# EAGLE schematic micro_RevA (EAGLE 6.5.0)
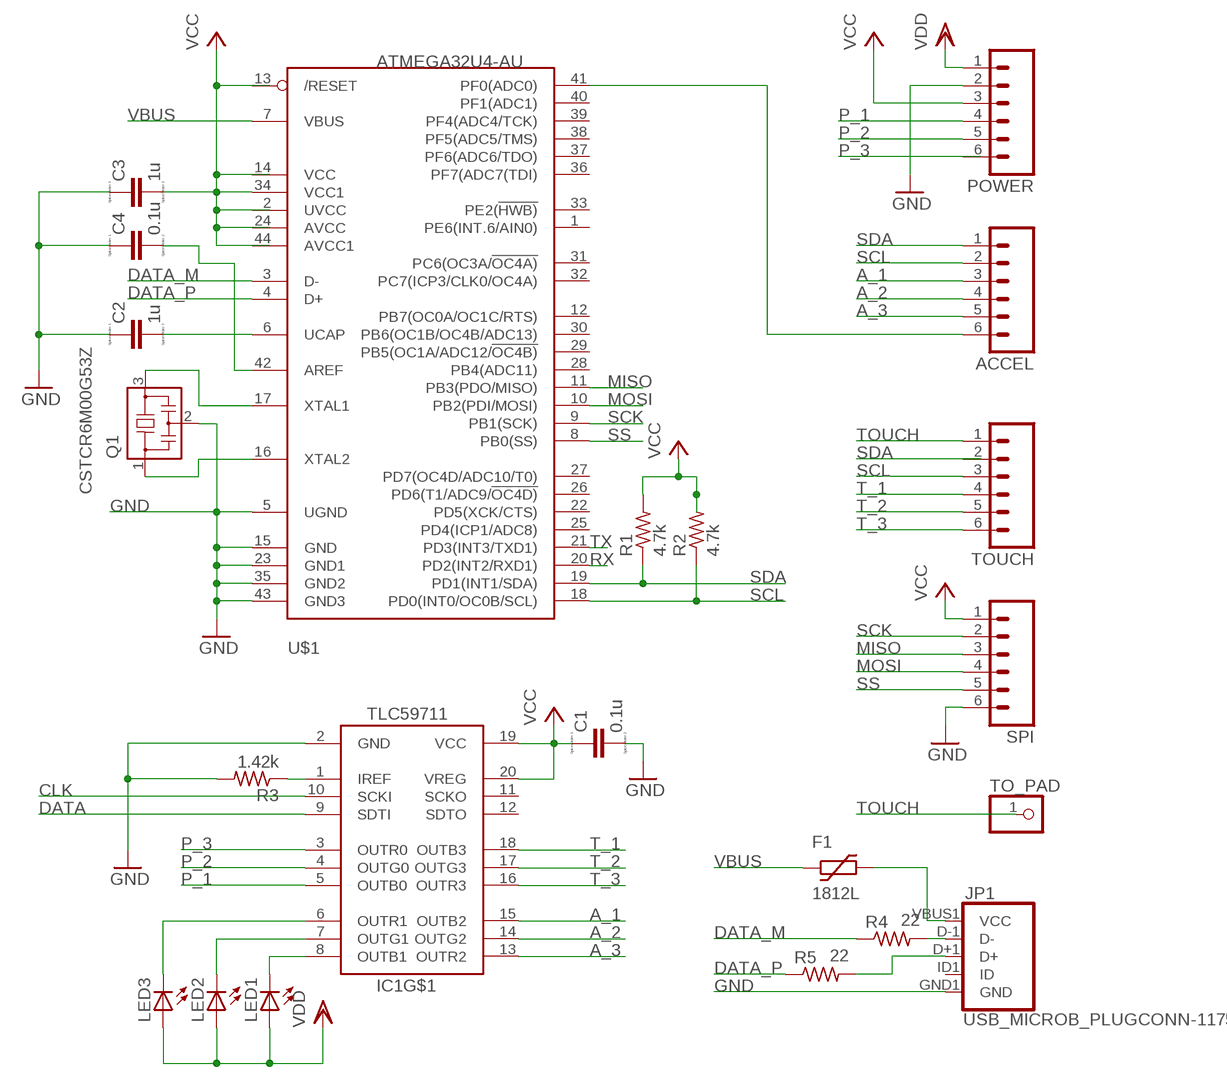
[diagram p0: schematic, sheet 1]

## Parts
ACCEL  M06SMD-STRAIGHT-ALT  [1X06_SMD_STRAIGHT_ALT]
C1  0.1u  CC0603  [C0603]
C2  1u  CC0603  [C0603]
C3  1u  CC0603  [C0603]
C4  0.1u  CC0603  [C0603]
F1  1812L  [1812L]
IC1  TLC59711  [HTSSOP20DAP]
JP1  USB_MICROB_PLUGCONN-11752  [USB-B-MICRO-SMD_V03]
LED1  LEDP-LCC-4  [P-LCC-4]
LED2  LEDP-LCC-4  [P-LCC-4]
LED3  LEDP-LCC-4  [P-LCC-4]
POWER  M06SMD-STRAIGHT-ALT  [1X06_SMD_STRAIGHT_ALT]
Q1  CSTCR6M00G53Z  [CSTCR6M]
R1  4.7k  R-US_R0603  [R0603]
R2  4.7k  R-US_R0603  [R0603]
R3  1.42k  R-US_R0603  [R0603]
R4  22  R-US_R0603  [R0603]
R5  22  R-US_R0603  [R0603]
SPI  M06SMD-STRAIGHT-ALT  [1X06_SMD_STRAIGHT_ALT]
TO_PAD  PINHD-1X1  [1X01]
TOUCH  M06SMD-STRAIGHT-ALT  [1X06_SMD_STRAIGHT_ALT]
U$1  ATMEGA32U4-AU  [TQFP44]

## Nets
A_1: ACCEL.3 IC1.15(OUTB2)
A_2: ACCEL.4 IC1.14(OUTG2)
A_3: ACCEL.5 IC1.13(OUTR2)
CLK: IC1.10(SCKI)
DATA: IC1.9(SDTI)
DATA_M: R4.1 U$1.3(D-)
DATA_P: R5.1 U$1.4(D+)
GND: C1.2 C2.1 C3.1 C4.1 IC1.2(GND) JP1.GND1(GND) POWER.2 Q1.2 R3.2 SPI.6 U$1.5(UGND) U$1.15(GND) U$1.23(GND1) U$1.35(GND2) U$1.43(GND3)
MISO: SPI.3 U$1.11(PB3(PDO/MISO))
MOSI: SPI.4 U$1.10(PB2(PDI/MOSI))
N$1: Q1.3 U$1.17(XTAL1)
N$2: Q1.1 U$1.16(XTAL2)
N$3: C4.2 U$1.42(AREF)
N$4: IC1.1(IREF) R3.1
N$5: IC1.6(OUTR1) LED3.C@4(C)
N$6: IC1.7(OUTG1) LED2.C@4(C)
N$7: IC1.8(OUTB1) LED1.C@4(C)
N$8: C2.2 U$1.6(UCAP)
N$9: ACCEL.6 U$1.41(PF0(ADC0))
N$10: JP1.D-1(D-) R4.2
N$11: JP1.D+1(D+) R5.2
N$12: F1.P$2 JP1.VBUS1(VCC)
P_1: IC1.5(OUTB0) POWER.4
P_2: IC1.4(OUTG0) POWER.5
P_3: IC1.3(OUTR0) POWER.6
RX: U$1.20(PD2(INT2/RXD1))
SCK: SPI.2 U$1.9(PB1(SCK))
SCL: ACCEL.2 R2.1 TOUCH.3 U$1.18(PD0(INT0/OC0B/SCL))
SDA: ACCEL.1 R1.1 TOUCH.2 U$1.19(PD1(INT1/SDA))
SS: SPI.5 U$1.8(PB0(SS))
T_1: IC1.18(OUTB3) TOUCH.4
T_2: IC1.17(OUTG3) TOUCH.5
T_3: IC1.16(OUTR3) TOUCH.6
TOUCH: TO_PAD.1 TOUCH.1
TX: U$1.21(PD3(INT3/TXD1))
VBUS: F1.P$1 U$1.7(VBUS)
VCC: C1.1 C3.2 IC1.19(VCC) IC1.20(VREG) POWER.3 R1.2 R2.2 SPI.1 U$1.34(VCC1)
VDD: LED1.A LED2.A LED3.A POWER.1
Unconnected: IC1.11(SCKO) IC1.12(SDTO) IC1.EXP(PAD) JP1.ID1(ID) U$1.1(PE6(INT.6/AIN0)) U$1.2(UVCC) U$1.12(PB7(OC0A/OC1C/RTS)) U$1.13(/RESET) U$1.14(VCC) U$1.22(PD5(XCK/CTS)) U$1.24(AVCC) U$1.25(PD4(ICP1/ADC8)) U$1.26(PD6(T1/ADC9/!OC4D)) U$1.27(PD7(OC4D/ADC10/T0)) U$1.28(PB4(ADC11)) U$1.29(PB5(OC1A/ADC12/!OC4B)) U$1.30(PB6(OC1B/OC4B/ADC13)) U$1.31(PC6(OC3A/!OC4A)) U$1.32(PC7(ICP3/CLK0/OC4A)) U$1.33(PE2(!HWB)) U$1.36(PF7(ADC7(TDI)) U$1.37(PF6(ADC6/TDO)) U$1.38(PF5(ADC5/TMS)) U$1.39(PF4(ADC4/TCK)) U$1.40(PF1(ADC1)) U$1.44(AVCC1)

## Library data of the parts
ACCEL POWER SPI TOUCH = SparkFun-Connectors:M06: Header 6 Standard 6-pin 0.1" header. Use with straight break away headers (SKU : PRT-00116), right angle break away headers (PRT-00553), swiss pins (PRT-00743), machine pins (PRT-00117), and female headers (PRT-00115). Molex polarized connector foot print use with SKU : PRT-08094 with associated crimp pins and housings. NOTES ON THE VARIANTS LOCK and LOCK_LONGPADS... This footprint was designed to help hold the alignment of a through-hole component (i.e. 6-pin header) while soldering it into place. You may notice that each hole has been shifted either up or down by 0.005 of an inch from it's more standard position (which is a perfectly straight line). This slight alteration caused the pins (the squares in the middle) to touch the edges of the holes. Because they are alternating, it causes a "brace" to hold the component in place. 0.005 has proven to be the perfect amount of "off-center" position when using our standard breakaway headers. Although looks a little odd when you look at the bare footprint, once you have a header in there, the alteration is very hard to notice. Also,if you push a header all the way into place, it is covered up entirely on the bottom side. This idea of altering the position of holes to aid alignment will be further integrated into the Sparkfun Library for other footprints. It can help hold any component with 3 or more connection pins.
C1-C4 = eagle-ltspice:C: CAPACITOR, European symbol; SPICEMODEL: NONE; SPICEPREFIX: C
F1 = ptc-littlefuse:1812L
IC1 = adafruit:TLC59711
JP1 = SparkFun-Connectors:USB_MICROB_PLUG: USB Micro-B connectors Some male, some female. Watch your step!; PROD_ID: CONN-11752
LED1-LED3 = led:LED: LED OSRAM: - CHIPLED LG R971, LG N971, LY N971, LG Q971, LY Q971, LO R971, LY R971 LH N974, LH R974 LS Q976, LO Q976, LY Q976 LO Q996 - Hyper CHIPLED LW Q18S LB Q993, LB Q99A, LB R99A - SideLED LS A670, LO A670, LY A670, LG A670, LP A670 LB A673, LV A673, LT A673, LW A673 LH A674 LY A675 LS A676, LA A676, LO A676, LY A676, LW A676 LS A679, LY A679, LG A679 - Hyper Micro SIDELED® LS Y876, LA Y876, LO Y876, LY Y876 LT Y87S - SmartLED LW L88C, LW L88S LB L89C, LB L89S, LG L890 LS L89K, LO L89K, LY L89K LS L896, LA L896, LO L896, LY L896 - TOPLED LS T670, LO T670, LY T670, LG T670, LP T670 LSG T670, LSP T670, LSY T670, LOP T670, LYG T670 LG T671, LOG T671, LSG T671 LB T673, LV T673, LT T673, LW T673 LH T674 LS T676, LA T676, LO T676, LY T676, LB T676, LH T676, LSB T676, LW T676 LB T67C, LV T67C, LT T67C, LS T67K, LO T67K, LY T67K, LW E67C LS E67B, LA E67B, LO E67B, LY E67B, LB E67C, LV E67C, LT E67C LW T67C LS T679, LY T679, LG T679 LS T770, LO T770, LY T770, LG T770, LP T770 LB T773, LV T773, LT T773, LW T773 LH T774 LS E675, LA E675, LY E675, LS T675 LS T776, LA T776, LO T776, LY T776, LB T776 LHGB T686 LT T68C, LB T68C - Hyper Mini TOPLED® LB M676 - Mini TOPLED Santana® LG M470 LS M47K, LO M47K, LY M47K Source: http://www.osram.convergy.de LUXEON: - LUMILED® LXK2-PW12-R00, LXK2-PW12-S00, LXK2-PW14-U00, LXK2-PW14-V00 LXK2-PM12-R00, LXK2-PM12-S00, LXK2-PM14-U00 LXK2-PE12-Q00, LXK2-PE12-R00, LXK2-PE12-S00, LXK2-PE14-T00, LXK2-PE14-U00 LXK2-PB12-K00, LXK2-PB12-L00, LXK2-PB12-M00, LXK2-PB14-N00, LXK2-PB14-P00, LXK2-PB14-Q00 LXK2-PR12-L00, LXK2-PR12-M00, LXK2-PR14-Q00, LXK2-PR14-R00 LXK2-PD12-Q00, LXK2-PD12-R00, LXK2-PD12-S00 LXK2-PH12-R00, LXK2-PH12-S00 LXK2-PL12-P00, LXK2-PL12-Q00, LXK2-PL12-R00 Source: www.luxeon.com KINGBRIGHT: KA-3528ASYC Source: www.kingbright.com
Q1 = murata-filter:CSTCR: Resonator Source: murata.co.jp; MPN: CSTCR6M00G53-R0; OC_FARNELL: 1170434; OC_NEWARK: 25M8759
R1-R5 = resistor:R-US_: RESISTOR, American symbol
TO_PAD = pinhead:PINHD-1X1: PIN HEADER
U$1 = adafruit:ATMEGA32U4: http://www.ladyada.net/library/eagle